# Altium schematic sheet Probe-Scope ADC v1.0.SchDoc: Probe-Scope: ADC
size Tabloid; CompanyName: Probe-Scope; Organization: Probe-Scope; Address1: Probe-Scope: Unified USB; Address2: Oscilloscope Probe; Address3: ©2019 M. Omo, J. Rowley,; Address4: K. Hall, released under the; SheetNumber: 4; PageSetup: Record=PageOptions|CenterHorizontal=True|CenterVertical=True|PrintScale=0.96|XCorrection=1.00|YCorrection=1.00|PrintKind=1|BorderSize=5000000|LeftOffset=0|BottomOffset=0|Orientation=2|PaperLength=1000|PaperWidth=1000|Scale=100|PaperSource=7|PrintQuality=-4|MediaType=1|DitherType=10|PaperKind=11x17|PrintScaleMode=1; License: CERN OHL v1.2
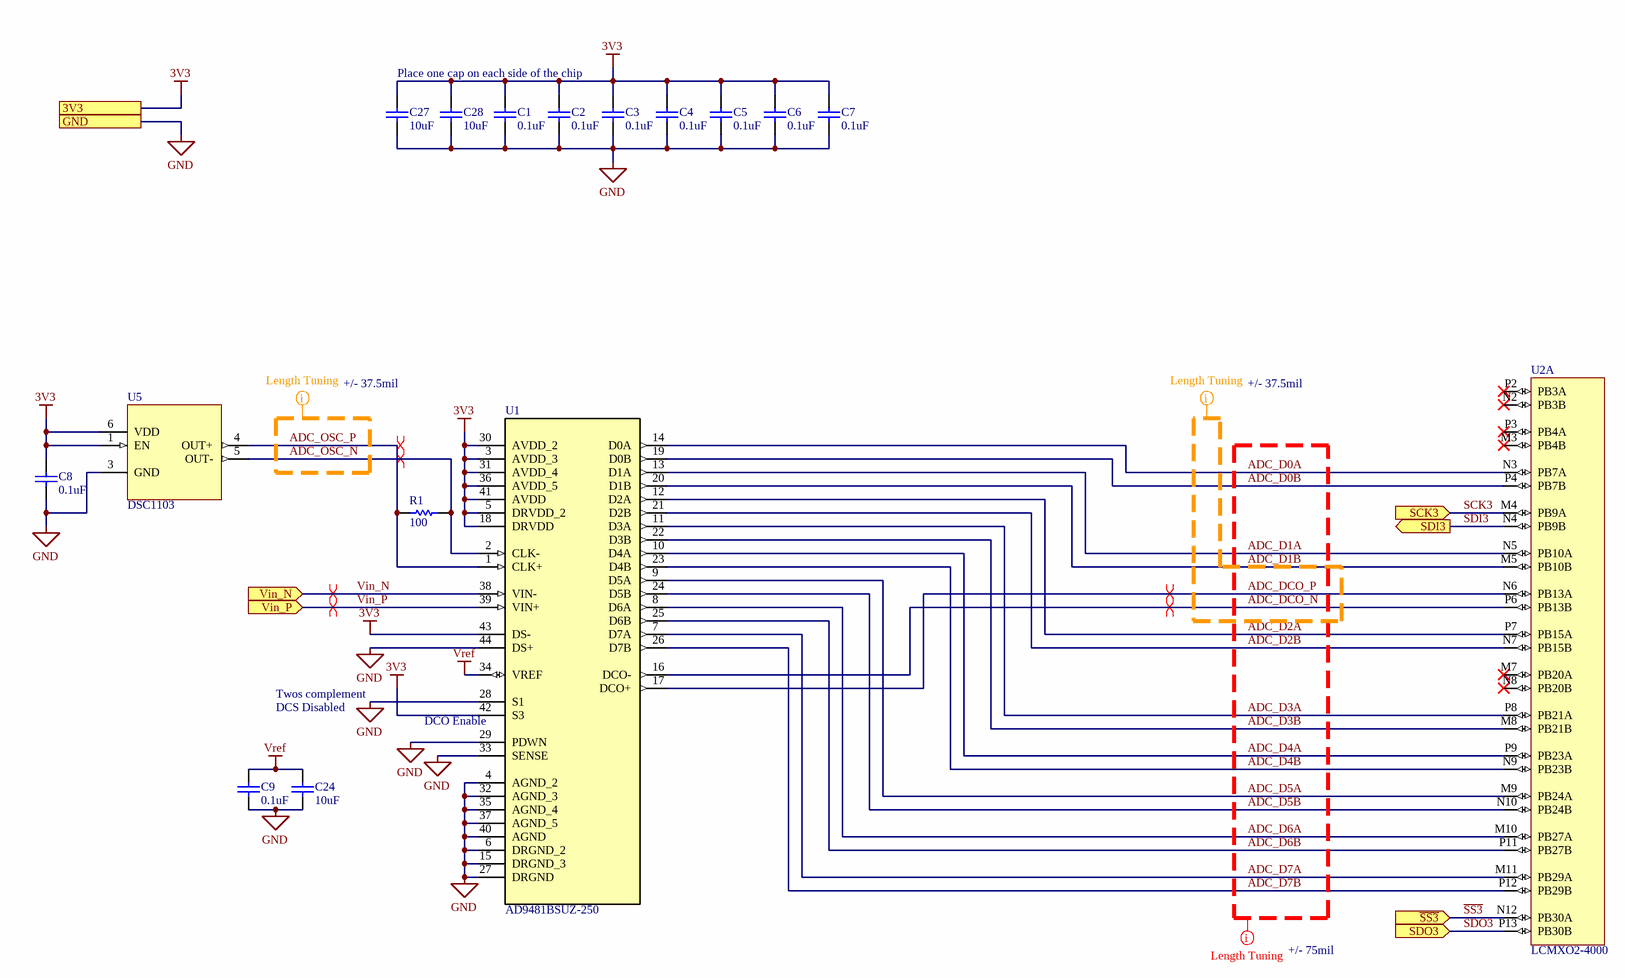
[diagram p0: Probe-Scope ADC v1.0.SchDoc]

## Parts
C1  value 0.1uF  [0402(1005)]  (hidden comment: 6.3V)
C2  value 0.1uF  [0402(1005)]  (hidden comment: 6.3V)
C3  value 0.1uF  [0402(1005)]  (hidden comment: 6.3V)
C4  value 0.1uF  [0402(1005)]  (hidden comment: 6.3V)
C5  value 0.1uF  [0402(1005)]  (hidden comment: 6.3V)
C6  value 0.1uF  [0402(1005)]  (hidden comment: 6.3V)
C7  value 0.1uF  [0402(1005)]  (hidden comment: 6.3V)
C8  value 0.1uF  [0402(1005)]  (hidden comment: 6.3V)
C9  value 0.1uF  [0402(1005)]  (hidden comment: 6.3V)
C24  value 10uF  [0603(1608)]  (hidden comment: 25V)
C27  value 10uF  [0603(1608)]  (hidden comment: 25V)
C28  value 10uF  [0603(1608)]  (hidden comment: 25V)
R1  value 100  [0402(1005)]  (hidden comment: Res1)
U1  AD9481BSUZ-250  [QFP80P1200X1200X120-44N]
U2  LCMXO2-4000  [132_Ball_csBGA_MachXO2]  (part A of 5)
U5  DSC1103  [MCHP_H5A]

## Ports
3V3, GND, SCK3 (in), SDI3 (out), SDO3 (in), Vin_N (in), Vin_P (in), ~{SS3} (in)

## Nets
3V3: C1.2 C2.2 C3.2 C4.2 C5.2 C6.2 C7.2 C8.2 C27.2 C28.2 U1.3(AVDD_3) U1.5(DRVDD_2) U1.18(DRVDD) U1.30(AVDD_2) U1.31(AVDD_4) U1.36(AVDD_5) U1.41(AVDD) U1.42(S3) U1.43(DS-) U5.1(EN) U5.6(VDD) ; port 3V3
GND: C1.1 C2.1 C3.1 C4.1 C5.1 C6.1 C7.1 C8.1 C9.1 C24.1 C27.1 C28.1 U1.4(AGND_2) U1.6(DRGND_2) U1.15(DRGND_3) U1.27(DRGND) U1.28(S1) U1.29(PDWN) U1.32(AGND_3) U1.33(SENSE) U1.35(AGND_4) U1.37(AGND_5) U1.40(AGND) U1.44(DS+) U5.3(GND) ; port GND
Vref: C9.2 C24.2 U1.34(VREF)
ADC_D0A: U1.14(D0A) U2.N3(PB7A)
ADC_D0B: U1.19(D0B) U2.P4(PB7B)
ADC_D1A: U1.13(D1A) U2.N5(PB10A)
ADC_D1B: U1.20(D1B) U2.M5(PB10B)
ADC_D2A: U1.12(D2A) U2.P7(PB15A)
ADC_D2B: U1.21(D2B) U2.N7(PB15B)
ADC_D3A: U1.11(D3A) U2.P8(PB21A)
ADC_D3B: U1.22(D3B) U2.M8(PB21B)
ADC_D4A: U1.10(D4A) U2.P9(PB23A)
ADC_D4B: U1.23(D4B) U2.N9(PB23B)
ADC_D5A: U1.9(D5A) U2.M9(PB24A)
ADC_D5B: U1.24(D5B) U2.N10(PB24B)
ADC_D6A: U1.8(D6A) U2.M10(PB27A)
ADC_D6B: U1.25(D6B) U2.P11(PB27B)
ADC_D7A: U1.7(D7A) U2.M11(PB29A)
ADC_D7B: U1.26(D7B) U2.P12(PB29B)
ADC_DCO_N: U1.16(DCO-) U2.P6(PB13B)
ADC_DCO_P: U1.17(DCO+) U2.N6(PB13A)
ADC_OSC_N: R1.2 U1.2(CLK-) U5.5(OUT-)
ADC_OSC_P: R1.1 U1.1(CLK+) U5.4(OUT+)
~{SS3}: U2.N12(PB30A) ; port ~{SS3}
SCK3: U2.M4(PB9A) ; port SCK3
SDI3: U2.N4(PB9B) ; port SDI3
SDO3: U2.P13(PB30B) ; port SDO3
Vin_N: U1.38(VIN-) ; port Vin_N
Vin_P: U1.39(VIN+) ; port Vin_P

Not connected (* = marked no-connect by the designer): U2 M3(PB4B)* M7(PB20A)* N2(PB3B)* N8(PB20B)* P2(PB3A)* P3(PB4A)*

## Layout directives
differential pair: ADC_DCO_N, ADC_DCO_P, ADC_OSC_N, ADC_OSC_P, Vin_N, Vin_P
net class ADC_DATA - 150mil: ADC_D0A, ADC_D0B, ADC_D1A, ADC_D1B, ADC_D2A, ADC_D2B, ADC_D3A, ADC_D3B, ADC_D4A, ADC_D4B, ADC_D5A, ADC_D5B, ADC_D6A, ADC_D6B, ADC_D7A, ADC_D7B, ADC_DCO_N, ADC_DCO_P
net class ADC_CLK - 37.5mil: ADC_D1B, ADC_DCO_N, ADC_DCO_P
net class ADC_OSC - 37.5mil: ADC_OSC_N, ADC_OSC_P

## Notes on the sheet
- Place one cap on each side of the chip
- +/- 37.5mil
- Twos complement
- DCS Disabled
- (near U1) DCO Enable
- +/- 75mil
- Title:
- Asm:
- Date:
- Variant:
- Time:
- Number:
- Sheet
- of
- Rev:
- File:

## Library data of the parts
C1-C9 = 1875: Key: 1875; MENG_PN: ???1875; MANF: Samsung Electro-Mechanics; MANF_PN: CL05B104KQ5NNNC; VENDOR: Digikey; VENDOR_PN: 1276-1511-1-ND; P&V Description: Capacitor, Ceramic, 0.1uF, 6.3V, 10% Tol, 125C, X7R, 0402, SMD; Class: Capacitor; Type: Ceramic; Other: X7R; Tolerance: 10; Voltage: 6.3; Max Temperature: 125; Approved: False; Package: 0402; SMD: True; Date Modified: 11/6/2018 11:14:02 AM; Modified By: jrowley; Parent Key: 1875; Verified: False
C24 C27 C28 = 1306: Key: 1306; MENG_PN: ???1306; MANF: Samsung Electro-Mechanics; MANF_PN: CL10A106MA8NRNC; VENDOR: Digikey; VENDOR_PN: 1276-1869-1-ND; P&V Description: Capacitor, Ceramic, 10uF, 25V, 20% Tol, 85C, X5R, 0603, SMD; Class: Capacitor; Type: Ceramic; Other: X5R; Tolerance: 20; Voltage: 25; Max Temperature: 85; Approved: True; Package: 0603; SMD: True; Date Modified: 3/3/2015 11:08:29 AM; Modified By: sotterbacher; Parent Key: 1306; Verified: True
R1 = 1823: Key: 1823; MENG_PN: ???1823; MANF: Yageo; MANF_PN: RC0402FR-07100RL; VENDOR: Digikey; VENDOR_PN: 311-100LRCT-ND; P&V Description: Resistor, Thick Film, 100 Ohms, 0.0625W, 1% Tol, 100V, 0402, SMD; Class: Resistor; Tolerance: 1; Power: 0.0625; Approved: False; Type: Thick Film; Package: 0402; SMD: True; Date Modified: 8/29/2018 2:46:23 AM; Modified By: jrowley; Voltage: 100; Expr1026: 1823; Parent Key: 1823; Verified: False
U1 = AD9481BSUZ-250: Single ADC Pipelined 250Msps 8-bit Parallel/LVDS 44-Pin TQFP Tray; VENDOR: DigiKey; MANF: Analog Devices Inc.; VENDOR_PN: AD9481BSUZ-250-ND; MANF_PN: AD9481BSUZ-250
U2 = MachXO2-4000: MANF_PN: LCMXO2-4000HC-4MG132C; MANF: Lattice Semiconductor; VENDOR: DigiKey; VENDOR_PN: 220-1458-ND
U5 = DSC1103: VENDOR: Mouser; MANF: Microchip Technology; MANF_PN: DSC1103CI3-250.0000; VENDOR_PN: 579-1103CI32500000